# Altium schematic sheet Main.SchDoc
size 203 x 127 mm
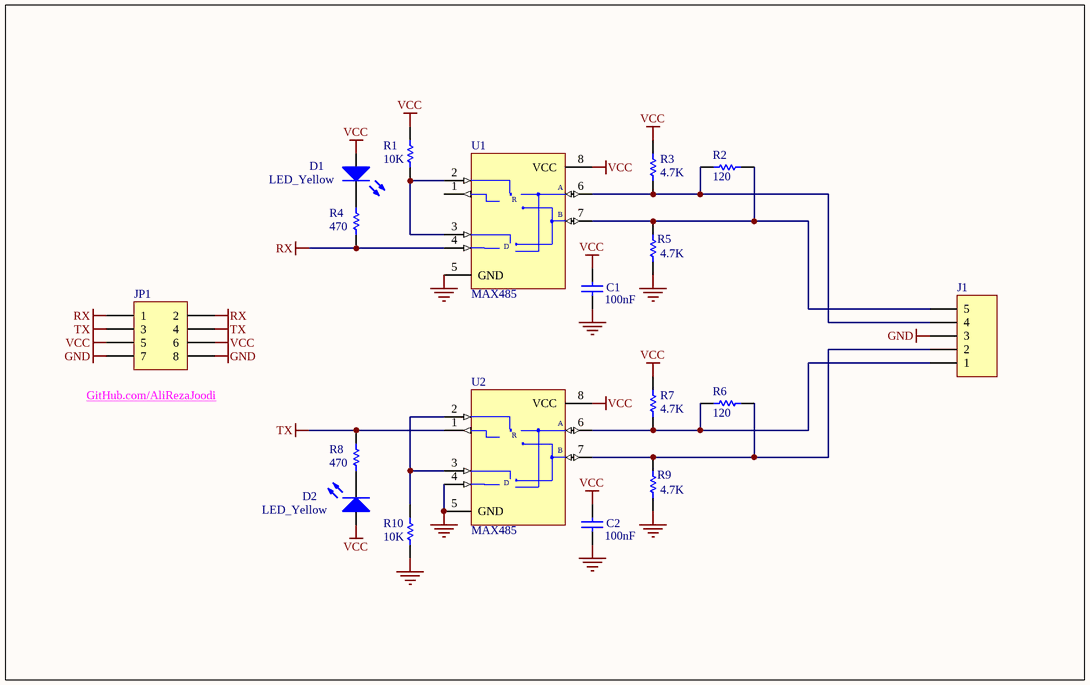
[diagram p0: Main.SchDoc]

## Parts
C1  100nF  [RAD0.1]
C2  100nF  [RAD0.1]
D1  LED_Yellow  [LED-5mm_Red]
D2  LED_Yellow  [LED-5mm_Red]
J1  Header 5  [Fonics_5PIN_1]  (value not drawn)
JP1  Header 4X2H  [HDR2X4H]  (value not drawn)
R1  10K  [AXIAL-0.4]
R2  120  [AXIAL-0.4]
R3  4.7K  [AXIAL-0.4]
R4  470  [AXIAL-0.4]
R5  4.7K  [AXIAL-0.4]
R6  120  [AXIAL-0.4]
R7  4.7K  [AXIAL-0.4]
R8  470  [AXIAL-0.4]
R9  4.7K  [AXIAL-0.4]
R10  10K  [AXIAL-0.4]
U1  MAX485  [PA8]
U2  MAX485  [PA8]

## Nets
GND: C1.1 C2.1 J1.3 JP1.7 JP1.8 R5.2 R9.2 R10.1 U1.5(GND) U2.4(DI) U2.5(GND)
RX: JP1.1 JP1.2 R4.1 U1.4(DI)
TX: JP1.3 JP1.4 R8.1 U2.1(RO)
VCC: C1.2 C2.2 D1.1(A) D2.1(A) JP1.5 JP1.6 R1.2 R3.1 R7.1 U1.8(VCC) U2.8(VCC)
NetD1_2: D1.2(K) R4.2
NetD2_2: D2.2(K) R8.2
NetJ1_1: J1.1 R6.1 R7.2 U2.6(A)
NetJ1_2: J1.2 R6.2 R9.1 U2.7(B)
NetJ1_4: J1.4 R2.1 R3.2 U1.6(A)
NetJ1_5: J1.5 R2.2 R5.1 U1.7(B)
NetR1_1: R1.1 U1.2(~{RE}) U1.3(DE)
NetR10_2: R10.2 U2.2(~{RE}) U2.3(DE)

Not connected (* = marked no-connect by the designer): U1 1(RO)

## Notes on the sheet
- (near JP1) GitHub.com/AliRezaJoodi
- (in symbol MAX485CPA) R; D

## Library data of the parts
C1 C2 = Cap: Capacitor; Manufacturer: Generic Components; Class I: Passive; Published: 8-Jun-2000; Revision: July-2002: Re-released for DXP Platform.; Publisher: Altium Limited; Class II: Capacitor
D1 D2 = LED: Typical INFRARED GaAs LED; Manufacturer: Generic Components; Class I: Optoelectronic; Published: 8-Jun-2000; Revision: July-2002: Re-released for DXP Platform.; Publisher: Altium Limited; Class II: LED
J1 = Header 5: Header, 5-Pin; LatestRevisionDate: 17-Jul-2002; LatestRevisionNote: Re-released for DXP Platform.; Publisher: Altium Limited
JP1 = Header 4X2H: Header, 4-Pin, Dual row,  Right Angle; Manufacturer: Generic Components; Class I: Connector; Revision: July-2002: Re-released for DXP Platform.; Publisher: Altium Limited
R1-R10 = Res1: Resistor; Published: 8-Jun-2000; LatestRevisionDate: 17-Jul-2002; LatestRevisionNote: Re-released for DXP Platform.; PackageReference: AXIAL-0.3; Publisher: Altium Limited
U1 U2 = MAX485CPA: Low-Power, Slew-Rate-Limited RS-485/RS-422 Transceiver; Published: 16-Jan-2001; LatestRevisionDate: 29-May-2009; LatestRevisionNote: Component Body Added.; DatasheetVersion: Feb-1996; PackageVersion: RevB, 21-0043; PackageReference: PA8; Publisher: Altium Limited; PackageDescription: DIP, 8-Pin, Row Spacing 7.62 mm, Pitch 2.54 mm; Code_JEDEC: MS-001-AB; ComponentLink1Description: Manufacturer Link; ComponentLink1URL: http://www.maxim-ic.com/; ComponentLink2Description: Datasheet; ComponentLink2URL: http://pdfserv.maxim-ic.com/en/ds/MAX1487-MAX491.pdf